# EAGLE design Pressure (EAGLE 7.2.0)
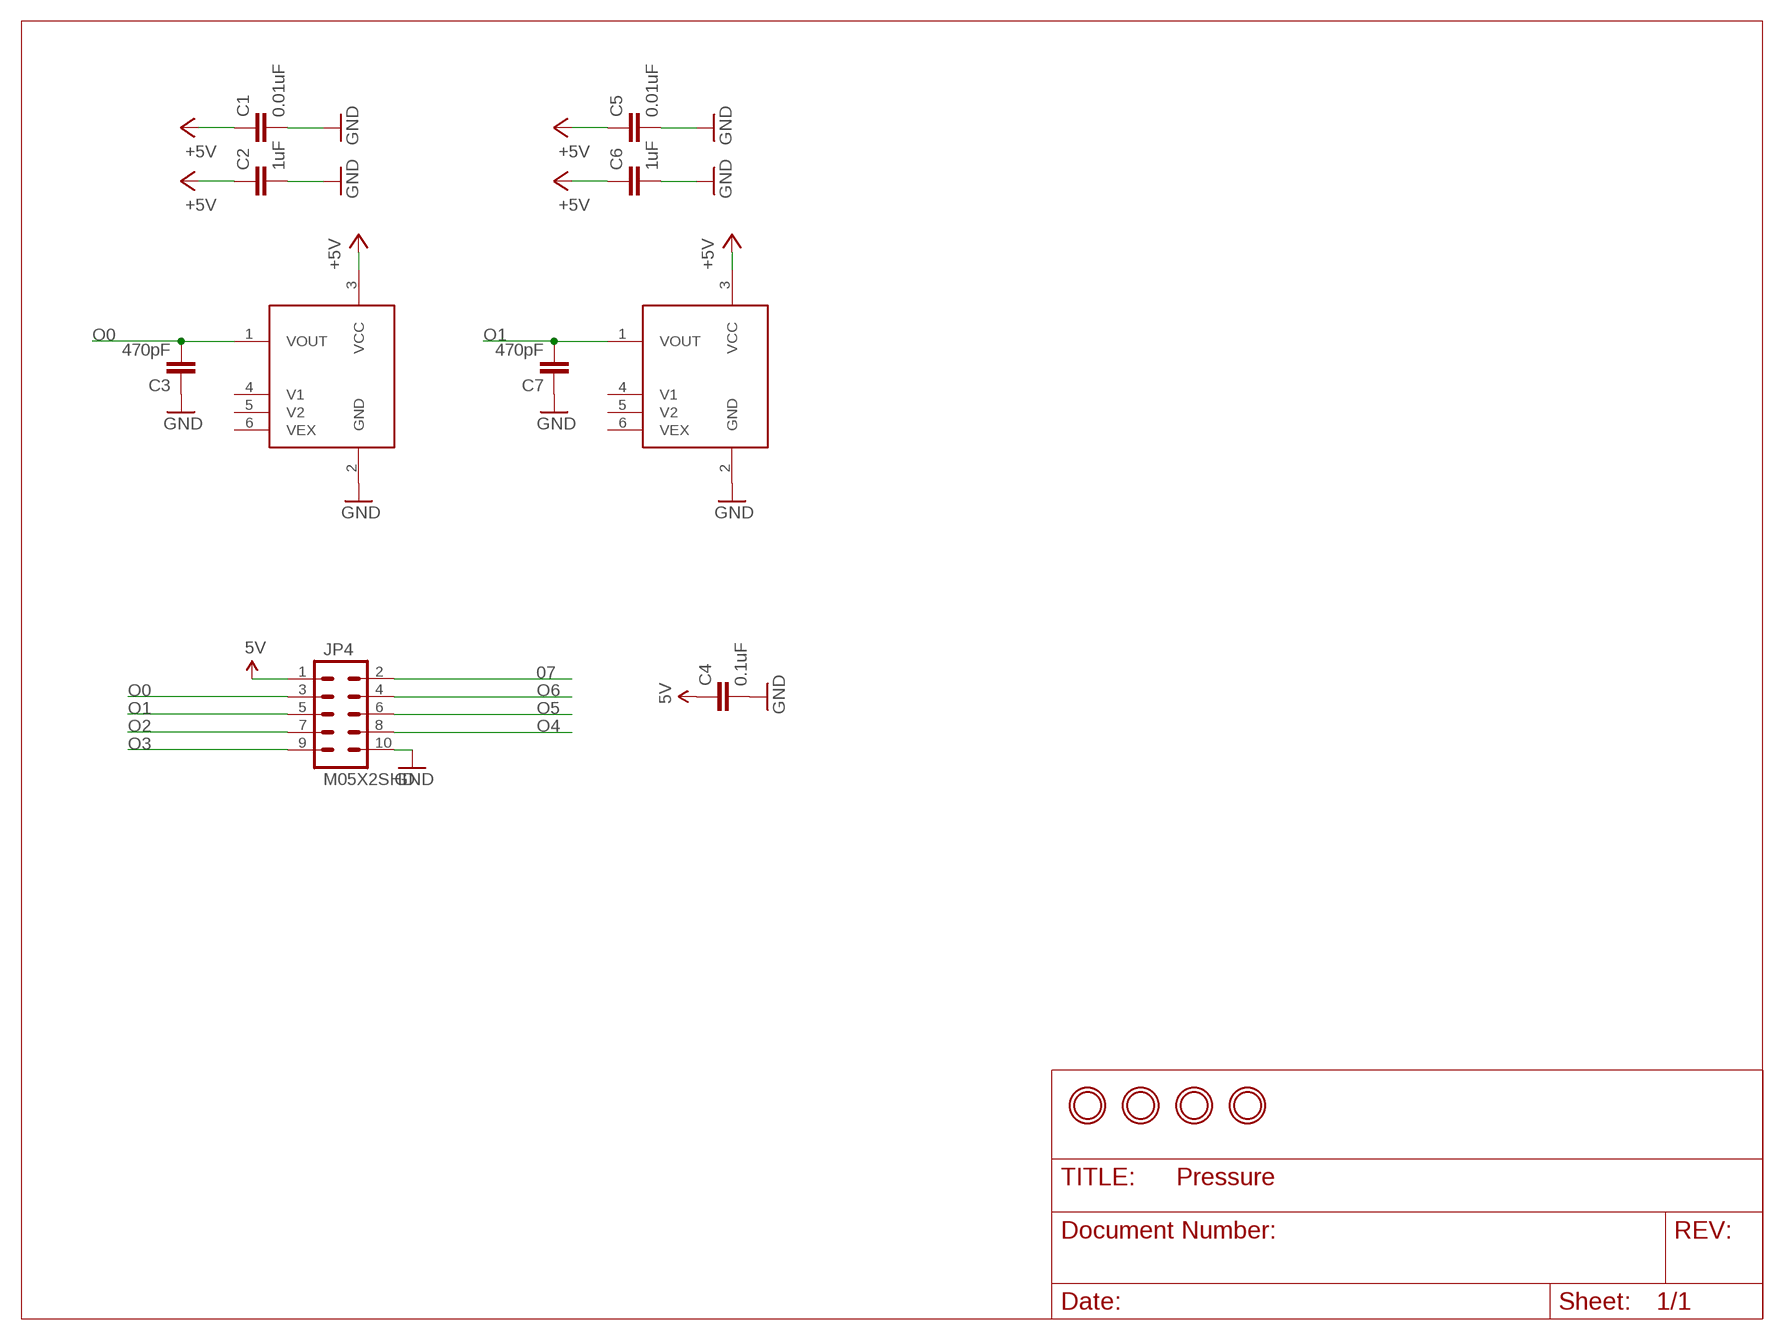
[diagram p0: schematic, sheet 1]

## Parts
C1  0.01uF  CAP0805  [0805]
C2  1uF  CAP0805  [0805]
C3  470pF  CAP0805  [0805]
C4  0.1uF  CAP0805  [0805]
C5  0.01uF  CAP0805  [0805]
C6  1uF  CAP0805  [0805]
C7  470pF  CAP0805  [0805]
JP4  M05X2SHD  [2X5-SHROUDED]
U$1  MPX5700  [MPX5700ASX]
U$2  MPX5700  [MPX5700ASX]
U$9  MOUNTINGHOLE2.0  [MOUNTINGHOLE_2.0_PLATED]
U$10  MOUNTINGHOLE2.0  [MOUNTINGHOLE_2.0_PLATED]
U$11  MOUNTINGHOLE2.0  [MOUNTINGHOLE_2.0_PLATED]
U$12  MOUNTINGHOLE2.0  [MOUNTINGHOLE_2.0_PLATED]

## Nets
5V: C4.1 JP4.1
07: JP4.2
+5V: C1.1 C2.1 C5.1 C6.1 U$1.3(VCC) U$2.3(VCC)
GND: C1.2 C2.2 C3.1 C4.2 C5.2 C6.2 C7.1 JP4.10 U$1.2(GND) U$2.2(GND)
O0: C3.2 JP4.3 U$1.1(VOUT)
O1: C7.2 JP4.5 U$2.1(VOUT)
O2: JP4.7
O3: JP4.9
O4: JP4.8
O5: JP4.6
O6: JP4.4
Unconnected: U$1.4(V1) U$1.5(V2) U$1.6(VEX) U$2.4(V1) U$2.5(V2) U$2.6(VEX)

## Library data of the parts
C1-C7 = SparkFun-Passives:CAP: Capacitor Standard 0603 ceramic capacitor, and 0.1" leaded capacitor.
JP4 = SparkFun-Connectors:M05X2: Header 5x2 Standard 10-pin dual row 0.1" header. Commonly used with AVR-ISP. Use with Spark Fun Electronics SKU: PRT-00778
U$1 U$2 = digikey:MPX5700
U$9-U$12 = microbuilder:MOUNTINGHOLE: Mounting Hole For #2 screws (0.086"/2.18mm width, 0.094"/2.4mm hole) use 2.5mm; BOM: EXCLUDE

## Net classes
0 default: width 0.203 mm
1 vcc: width 0.254 mm

## Board
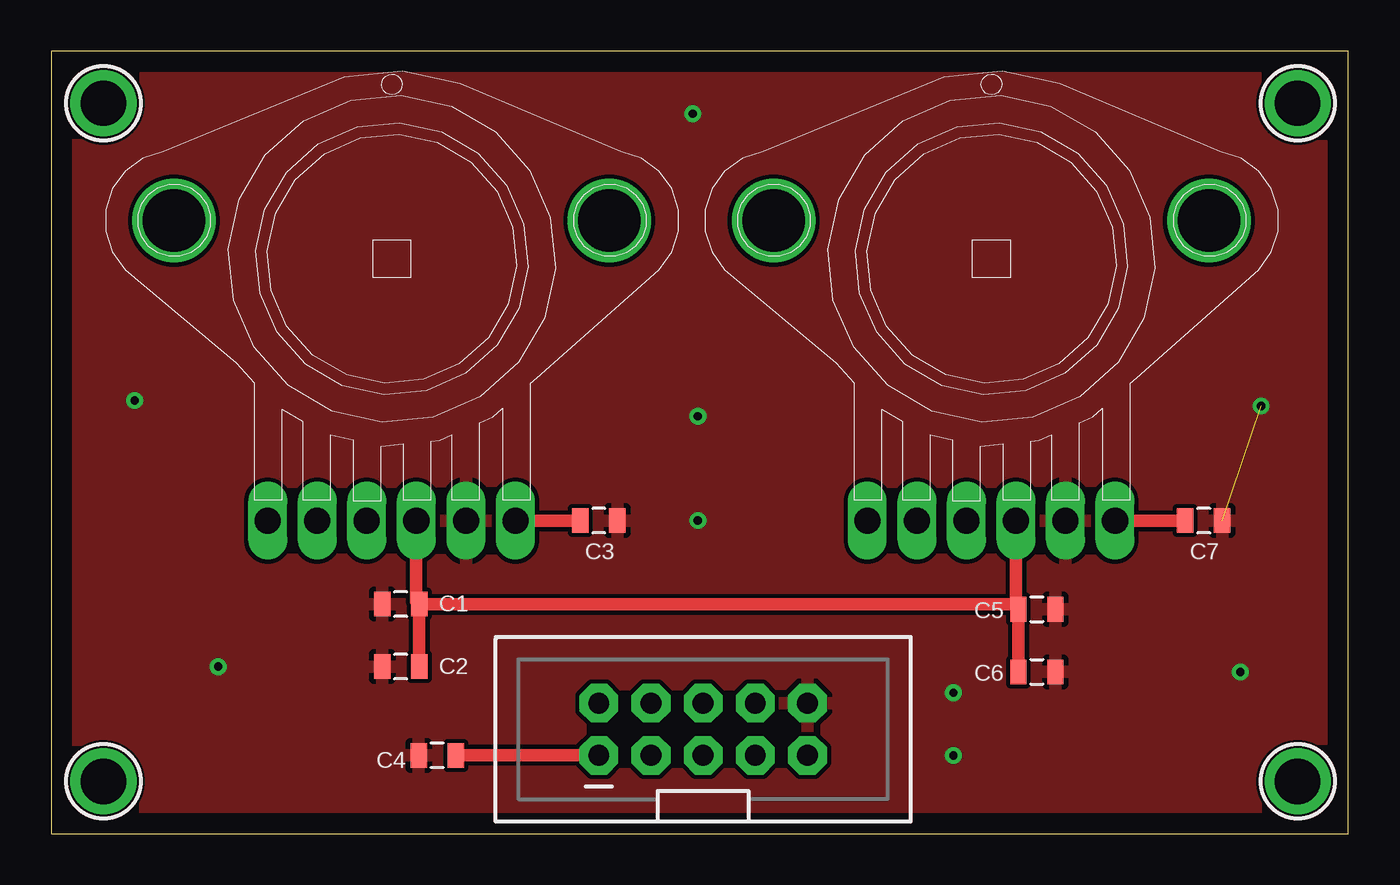
[diagram p1: board, top side]
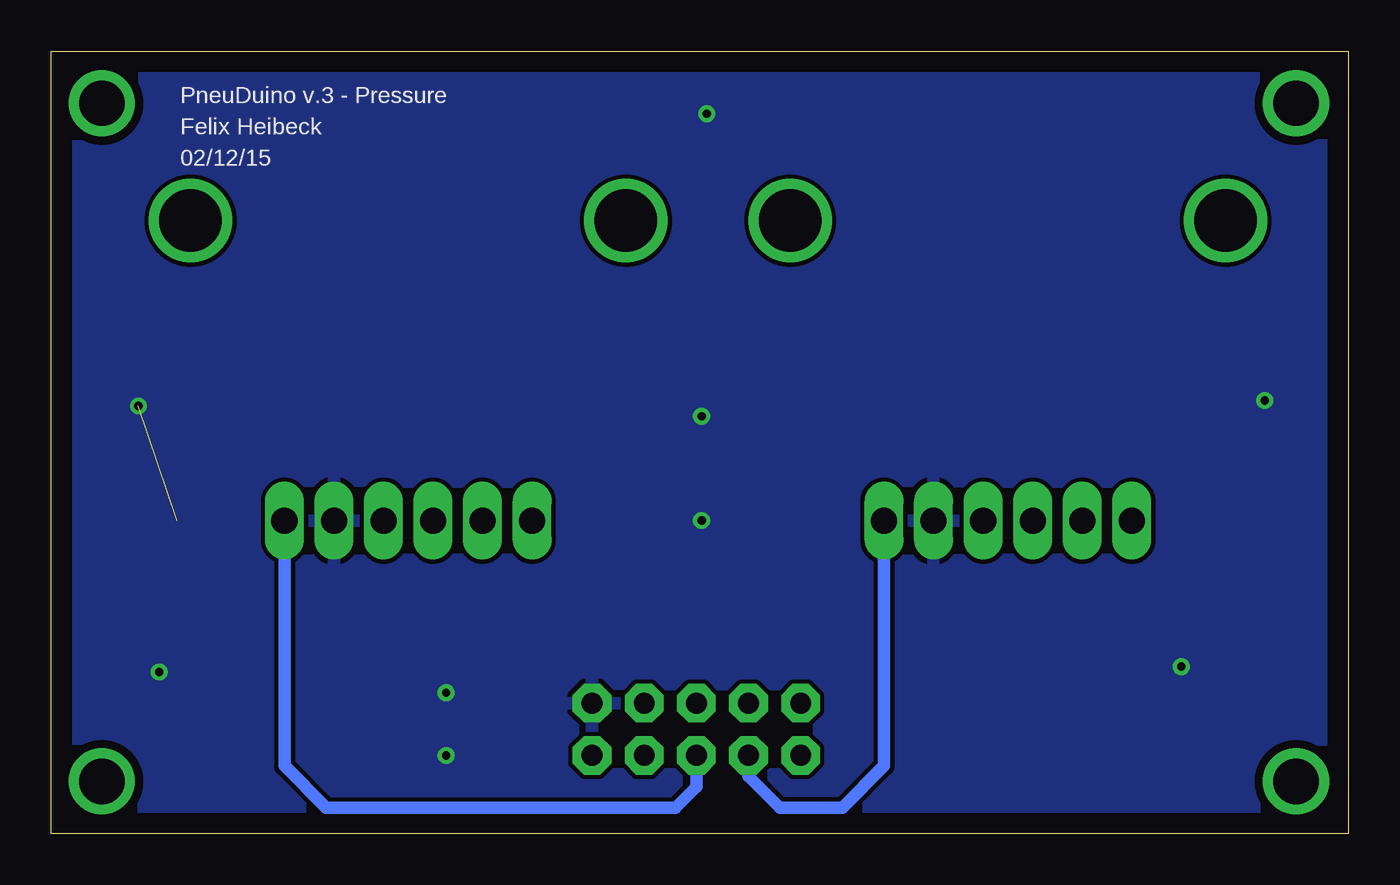
[diagram p2: board, bottom side, seen from below]

Size 63.17 x 38.09 mm. Coordinates in mm from the lower left corner, seen from the top.
Outline: 0,0 63.17,0 63.17,38.09 0,38.09 0,0
Copper layers (1*16): Top 0.035mm / dielectric 1.5mm / Bottom 0.035mm
Design rules "default": minimum track width 10mil, minimum drill 24mil, track to track 8mil, track to pad 8mil, pad to pad 8mil, via to via 8mil, smd to smd 8mil, copper to edge 40mil, drill to drill 8mil, minimum pad ring 10mil, minimum via ring 8mil, stop-mask expansion 4mil, vias tented up to drill 0mil, thermal gap 10mil

### Footprints (pad centres in the part's own frame; a part is rotated, then mirrored left to right if it is on the bottom)
0805 = smd 0.8 x 1.2: 1 -0.9,0; 2 0.9,0
2X5-SHROUDED = drill 1.016 pad 1.88 octagon: 1 -1.27,5.08; 2 1.27,5.08; 3 -1.27,2.54; 4 1.27,2.54; 5 -1.27,0; 6 1.27,0; 7 -1.27,-2.54; 8 1.27,-2.54; 9 -1.27,-5.08; 10 1.27,-5.08
MPX5700ASX = drill 1.27 long: 1 6.096,-12.7; 2 3.683,-12.7; 3 1.27,-12.7; 4 -1.143,-12.7; 5 -3.556,-12.7; 6 -5.969,-12.7 | drill 3.048: P$1 -10.541,1.905; P$2 10.668,1.905
MOUNTINGHOLE_2.0_PLATED = drill 2.2 pad 3: P$1 0,0

### Placement (x,y rotation side)
C1  17.02,11.18 180 top
C2  17.02,8.13 180 top
C3  26.67,15.24 180 top
C4  18.8,3.81 180 top
C5  48.01,10.92 0 top
C6  48.01,7.87 0 top
C7  56.13,15.24 180 top
JP4  31.75,5.08 90 top
U$1  16.51,27.94 0 top
U$2  45.72,27.94 0 top
U$9  2.54,35.56 0 top
U$10  60.71,2.54 0 top
U$11  60.71,35.56 0 top
U$12  2.54,2.54 0 top

### Tracks (layer width: path | path; a pad name or v marks a point on that pad's centre or on a via)
5V
  Top 0.61: JP4.1 C4.1
+5V
  Top 0.61: U$1.3 17.78,11.29 C1.1 | C1.1 C2.1 | U$2.3 46.99,11.04 C5.1 | C5.1 C6.1 | C1.1 46.85,11.18 C5.1
GND  (via drill 0.41)  (1 unrouted)
  other vias: 31.5,15.24 31.5,20.32 31.24,35.05 4.06,21.08 8.13,8.13 43.94,3.81 43.94,6.86 57.91,7.87 58.93,20.83
  pour Bottom: -0.76,38.86 64.01,38.86 64.01,-1.02 -0.76,-1.02
  pour Top: -0.76,39.62 65.02,39.62 65.02,-1.78 -1.78,-1.78 -1.78,39.62
O0
  Top 0.61: U$1.1 C3.2
  Bottom 0.61: U$1.1 22.61,3.3 24.64,1.27 27.69,1.27 29.21,2.79 JP4.3
O1
  Top 0.61: U$2.1 C7.2
  Bottom 0.61: U$2.1 51.82,3.3 49.78,1.27 32.77,1.27 31.75,2.29 JP4.5

### Text on the board
bPlace: PneuDuino v.3 - Pressure | Felix Heibeck | 02/12/15